# Altium schematic sheet Power_DDRTermination.SchDoc
size 431 x 279 mm
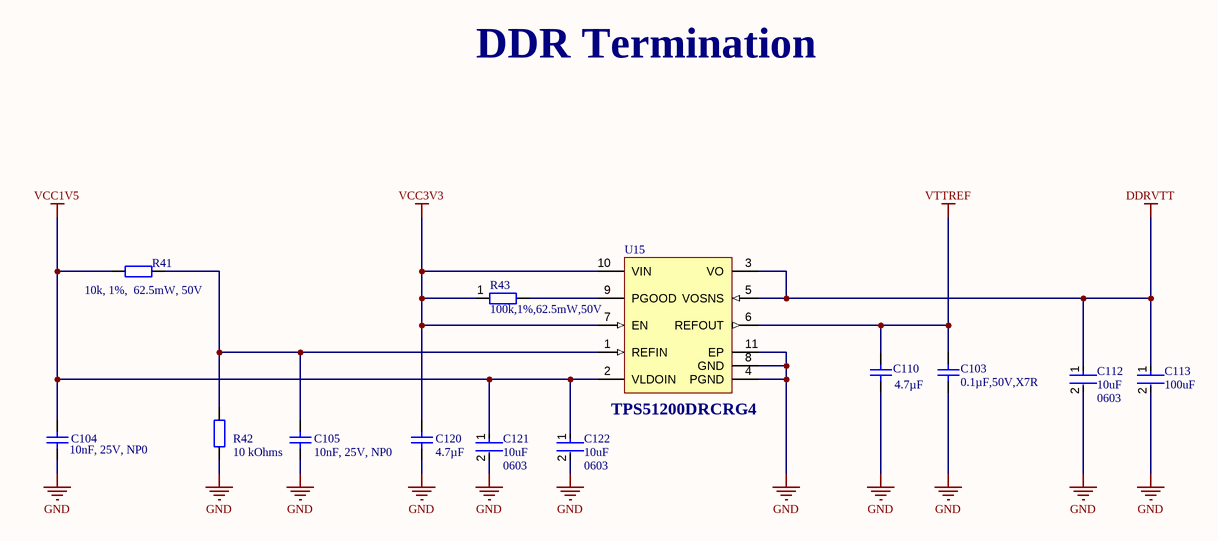
[diagram p0: Power_DDRTermination.SchDoc]

## Parts
C103  value 0.1µF,50V,X7R  [CAP0402i]  (hidden comment: 0.1µF)
C104  value 10nF, 25V, NP0  [CAP0402i]  (hidden comment: 10nF)
C105  value 10nF, 25V, NP0  [CAP0402i]  (hidden comment: 10nF)
C110  4.7µF  [CAP0402i]
C112  Capacitance: 10uF  Case/Package: 0603  [FP-GRM188-0_1-e0_2_0_55-IPC_A]  (hidden comment: GRM188R60J106ME47D)
C113  value 100uF  [FP-GRM32-0_3-MFG]  (hidden comment: GRM32ER60J107ME20L)
C120  4.7µF  [CAP0402i]
C121  Capacitance: 10uF  Case/Package: 0603  [FP-GRM188-0_1-e0_2_0_55-IPC_A]  (hidden comment: GRM188R60J106ME47D)
C122  Capacitance: 10uF  Case/Package: 0603  [FP-GRM188-0_1-e0_2_0_55-IPC_A]  (hidden comment: GRM188R60J106ME47D)
R41  value 10k, 1%,  62.5mW, 50V  [RES0402i]  (hidden comment: 10 kOhms)
R42  10 kOhms  [RES0402i]
R43  value 100k,1%,62.5mW,50V  [RES0402i]  (hidden comment: 100 kOhms)
U15  TPS51200DRCRG4  [TI-DRC10-2400X1650TP_V]

## Nets
DDRVTT: C112.1 C113.1 U15.3(VO) U15.5(VOSNS)
GND: C103.1 C104.1 C105.1 C110.1 C112.2 C113.2 C120.1 C121.2 C122.2 R42.1 U15.4(PGND) U15.8(GND) U15.11(EP)
VCC1V5: C104.2 C121.1 C122.1 R41.1 U15.2(VLDOIN)
VCC3V3: C120.2 R43.1 U15.7(EN) U15.10(VIN)
VTTREF: C103.2 C110.2 U15.6(REFOUT)
NetC105_2: C105.2 R41.2 R42.2 U15.1(REFIN)
NetR43_2: R43.2 U15.9(PGOOD)

## Notes on the sheet
- DDR Termination
- DWG. NO.
- REV.
- SHT.
- THIS DOCUMENT AND THE DATA DISCLOSED HEREIN OR HEREWITH IS THE PROPERTY OF ALTIUM LIMITED AND MAY BE FREELY DISTRIBUTED IN WHOLE. NO RIGHTS ARE RESERVED OR EXPRESS OR IMPLIED WARANTEE GIVEN.
- REVISION
- DESCRIPTION
- DATE
- APPROVED
- ENG:
- APPROVALS
- PROJECT
- DSN:
- CHK:
- REFERENCE DOCUMENTS
- PROJECT REVISION:
- TITLE
- DOCUMENT REVISION:
- DESIGN ITEM:
- BOM:
- FAB DWG:
- PCB DWG:
- ASSY DWG:
- SCALE:
- SIZE
- B
- CAGE CODE
- FILE NAME
- DWG NO.
- SHEET
- OF
- REV

## Library data of the parts
C103 = Cap_0.1uF_50V_X7R_0402: 0402, 0.1uF, 10%,  50V, X7R; Part Number: C1005X7R1H104K050BE; Manufacturer 1: TDK; Type: Ceramic; Voltage: 50V; Temperature Coefficient: X7R; Tolerance: ±10%; Operating Temperature: -55°C ~ 125°C; Mounting Type: SMT; Package: 0402 (1005 Metric); Applications: Automotive; Ratings: AEC-Q200; Supplier 1: Mouser; Supplier Part Number 1: 810-C1005X7R1H104KBE; Manufacturer Part Number 1: C1005X7R1H104K050BE; Component Type: Generic; Capacitance: 0.1µF; Note: *; Supplier 2: DigiKey; Supplier 3: Farnell; Supplier Part Number 2: 445-173610-1-ND; Supplier Part Number 3: 3416071
C104 C105 = Cap_10nF_25V_NP0_0402: 0402,10nF,5%,25V,NP0; Part Number: GRM1555C1E103JE01J; Manufacturer: Murata; Type: Ceramic; Voltage: 25V; Temperature Coefficient: NP0; Tolerance: ±5%; Operating Temperature: -55°C ~ 125°C; Mounting Type: SMT; Package: 0402 (1005 Metric); Supplier 1: Mouser; Supplier Part Number 1: 81-GRM1555C1E103JE1J; Manufacturer Part Number 1: GRM1555C1E103JE01J; Component Type: Generic; Capacitance: 10nF; Note: *; Supplier 2: DigiKey; Supplier 3: Farnell; Supplier Part Number 2: *; Supplier Part Number 3: *
C110 C120 = Cap_4.7uF_10V_10%_0402: CAP CER 4.7UF 10V X5R 0402; Part Number: C1005X5R1A475K050BC; Manufacturer 1: TDK; Value: 4.7µF, 10V, X5R; Tolerance: 10%; Dielectric Material: Ceramic; RoHS: Yes; Lead Free: Lead Free; ComponentLink2Description: https://datasheet.ciiva.com/14895/tdkmlcccaprange-14895670.pdf?src-supplier=Digi-Key; ComponentLink2URL: https://datasheet.ciiva.com/14895/tdkmlcccaprange-14895670.pdf?src-supplier=Digi-Key; Category: Ceramic Capacitors; Capacitance: 4.7µF; Voltage Rating: 10V; Supplier 1: Mouser; Manufacturer Part Number 1: C1005X5R1A475K050BC; Stock 1: 1272492; Mount: Surface Mount; Case/Package: 0402; Case Code (Metric): 1005; Case Code (Imperial): 0402; Min Operating Temperature: -55°C; Max Operating Temperature: 85°C; Package Quantity: 10000; Packaging: Cut Tape; Voltage Rating (DC): 10V; Series: C; Dielectric: X5R; Length: 0.039inch; Width: 0.02inch; Thickness: 0.022inch; RoHS Compliant: Yes; Reach SVHC Compliant: Yes; ComponentLink1URL: https://datasheet.ciiva.com/14895/tdkmlcccaprange-14895671.pdf?src-supplier=Digi-Key; ComponentLink1Description: https://datasheet.ciiva.com/14895/tdkmlcccaprange-14895671.pdf?src-supplier=Digi-Key; ComponentLink3URL: https://datasheet.ciiva.com/14895/tdkmlcccaprange-14895672.pdf?src-supplier=Digi-Key; ComponentLink3Description: https://datasheet.ciiva.com/14895/tdkmlcccaprange-14895672.pdf?src-supplier=Digi-Key; Supplier Part Number 1: 810-C1005X5R1A475KBC; Component Type: Generic
C112 C121 C122 = CMP-2006-02792-2: Chip Multilayer Ceramic Capacitors for General Purpose, 0603, 10uF, X5R, 15%, 20%, 6.3V; Packaging: Tape and Reel; Voltage Rating (DC): 6.3V; Width: 0.031inch; Termination: SMD/SMT; Dielectric: X5R; Package Quantity: 4000; Voltage Rating: 6.3V; Min Operating Temperature: -55°C; Voltage: 6.3V; Length: 1.6mm; Thickness: 0.035inch; Lead Free: Lead Free; Depth: 0.8mm; Case Code (Imperial): 0603; Max Operating Temperature: 85°C; Material: Ceramic; Height: 0.8mm; Tolerance: 20%; Mount: Surface Mount; REACH SVHC: No SVHC; Radiation Hardening: No; Case Code (Metric): 1608
C113 = CMP-2000-05259-2: CAP CER 100UF 6.3V X5R 1210; 3DS Part Number: 220-00002; Manufacturer: Murata; Temperature Coefficient: 15%; Material: Ceramic; Tolerance: 20%; Octopart: https://octopart.com/grm32er60j107me20l-murata-197007; ComponentLink2URL: https://search.murata.co.jp/Ceramy/image/img/A01X/G101/ENG/GRM32ER60J107ME20-01.pdf; Temperature Range High: +85°C; RoHS: TRUE; Device Class L3: Ceramic Capacitors; Manufacturer Part Number: GRM32ER60J107ME20L; Device Class L2: Capacitors; Voltage: 6.3V; Package: GRM32-0.3; Voltage Rating: 6.3V; Category: Cap; Device Class L1: Passive Components; Temperature Characteristic: X5R; Automotive: No; Digikey Description: CAP CER 100UF 6.3V X5R 1210; Temperature: -55°C to +85°C; Height: 2.7mm; Ipc Land Pattern Name: CAPC320250X250; Capacitance: 100uF; Temperature Range Low: -55°C; Lead Free: Yes; ComponentLink2Description: Datasheet
R41 = Res_10k_1%_0402: 0402, 10K 1%,  62.5mW, 50V; Part Number: CR0402-FX-1002GLF; Manufacturer 1: Bourns; Temperature Coefficient: 100 PPM / C; Voltage: 50V; Tolerance: ±1%; Operating Temperature: -55°C ~ 125°C; Mounting Type: SMT; Package: 0402 (1005 Metric); Supplier 1: Mouser; Supplier Part Number 1: 652-CR0402FX-1002GLF; Manufacturer Part Number 1: CR0402-FX-1002GLF; Component Type: Generic; Resistance: 10 kOhms; Note: *; Supplier 2: DigiKey; Supplier 3: Farnell; Supplier Part Number 2: CR0402-FX-1002GLFCT-ND; Supplier Part Number 3: 2333566
R42 = Res_10k_1%_0402: 0402, 10K 1%,  62.5mW, 50V; Part Number: CR0402-FX-1002GLF; Manufacturer 1: Bourns; Temperature Coefficient: 100 PPM / C; Value: 10k, 1%,  62.5mW, 50V; Voltage: 50V; Tolerance: ±1%; Operating Temperature: -55°C ~ 125°C; Mounting Type: SMT; Package: 0402 (1005 Metric); Supplier 1: Mouser; Supplier Part Number 1: 652-CR0402FX-1002GLF; Manufacturer Part Number 1: CR0402-FX-1002GLF; Component Type: Generic; Resistance: 10 kOhms; Note: *; Supplier 2: DigiKey; Supplier 3: Farnell; Supplier Part Number 2: CR0402-FX-1002GLFCT-ND; Supplier Part Number 3: 2333566
R43 = Res_100K_1%_0402: 0402, 100k, 1%, 62.5mW, 50V; Part Number: CR0402-FX-1003GLF; Manufacturer 1: Bourns; Temperature Coefficient: 100 PPM / C; Voltage: 50 V; Tolerance: ±1%; Operating Temperature: -55°C ~ 125°C; Mounting Type: SMT; Package: 0402 (1005 Metric); Supplier 1: Mouser; Supplier Part Number 1: 652-CR0402FX-1003GLF; Manufacturer Part Number 1: CR0402-FX-1003GLF; Component Type: Generic; Resistance: 100 kOhms; Note: *; Supplier 2: DigiKey; Supplier 3: Farnell; Supplier Part Number 2: CR0402-FX-1003GLFCT-ND; Supplier Part Number 3: 2787798
U15 = CMP-0395-00657-1: Single Output LDO, 3 A, 2.375 to 3.5 V Input, with DDR Termination, 10-pin SON (DRC), -40 to 85 degC, Green (RoHS & no Sb/Br); Manufacturer: Texas Instruments; Iq(Typ)(mA): 0.5; Power Good: TRUE; SubFamily: Single Channel LDO; Iout(Max)(A): 3; Vin(Max)(V): 3.5; Rating: Catalog; Vin(Min)(V): 2.3; PackageVersion: 4204102-3/L; ComponentLink2Description: Datasheet; ComponentLink3URL: http://www.ti.com/litv/pdf/mpds117k; ComponentLink1Description: Manufacturer URL; PackageDescription: 10-Pin Plastic Small Outline, Body 3 x 3 mm, Pitch 0.5 mm; ComponentLink1URL: http://www.ti.com/; ComponentLink4URL: Samples URL:http://www.ti.com/product/tps51200#samples; PackageReference: DRC10-2400X1650TP; ComponentLink4Description: URL Link1; ComponentLink3Description: Package Specification; DatasheetVersion: SLUS812; Eco-Plan: Green (RoHS & no Sb/Br); PartNumber: TPS51200DRCRG4; ComponentLink2URL: http://www.ti.com/general/docs/lit/getliterature.tsp?genericPartNumber=TPS51200&fileType=pdf; Mounting Technology: Surface Mount